# EasyEDA Pro project Cardy PCB.eprj

# Schematic Schematic
Create Date: 2023-10-29; Page Name: P1; Project Name: Cardy PCB; Schematic Name: Schematic; Update Date: 2023-10-31; Company: EasyEDA.com; Drawed: EasyEDA Pro; Page Size: A4; Part Number: JLCPCB-002; Reviewed: EasyEDA Pro; Version: V0.1
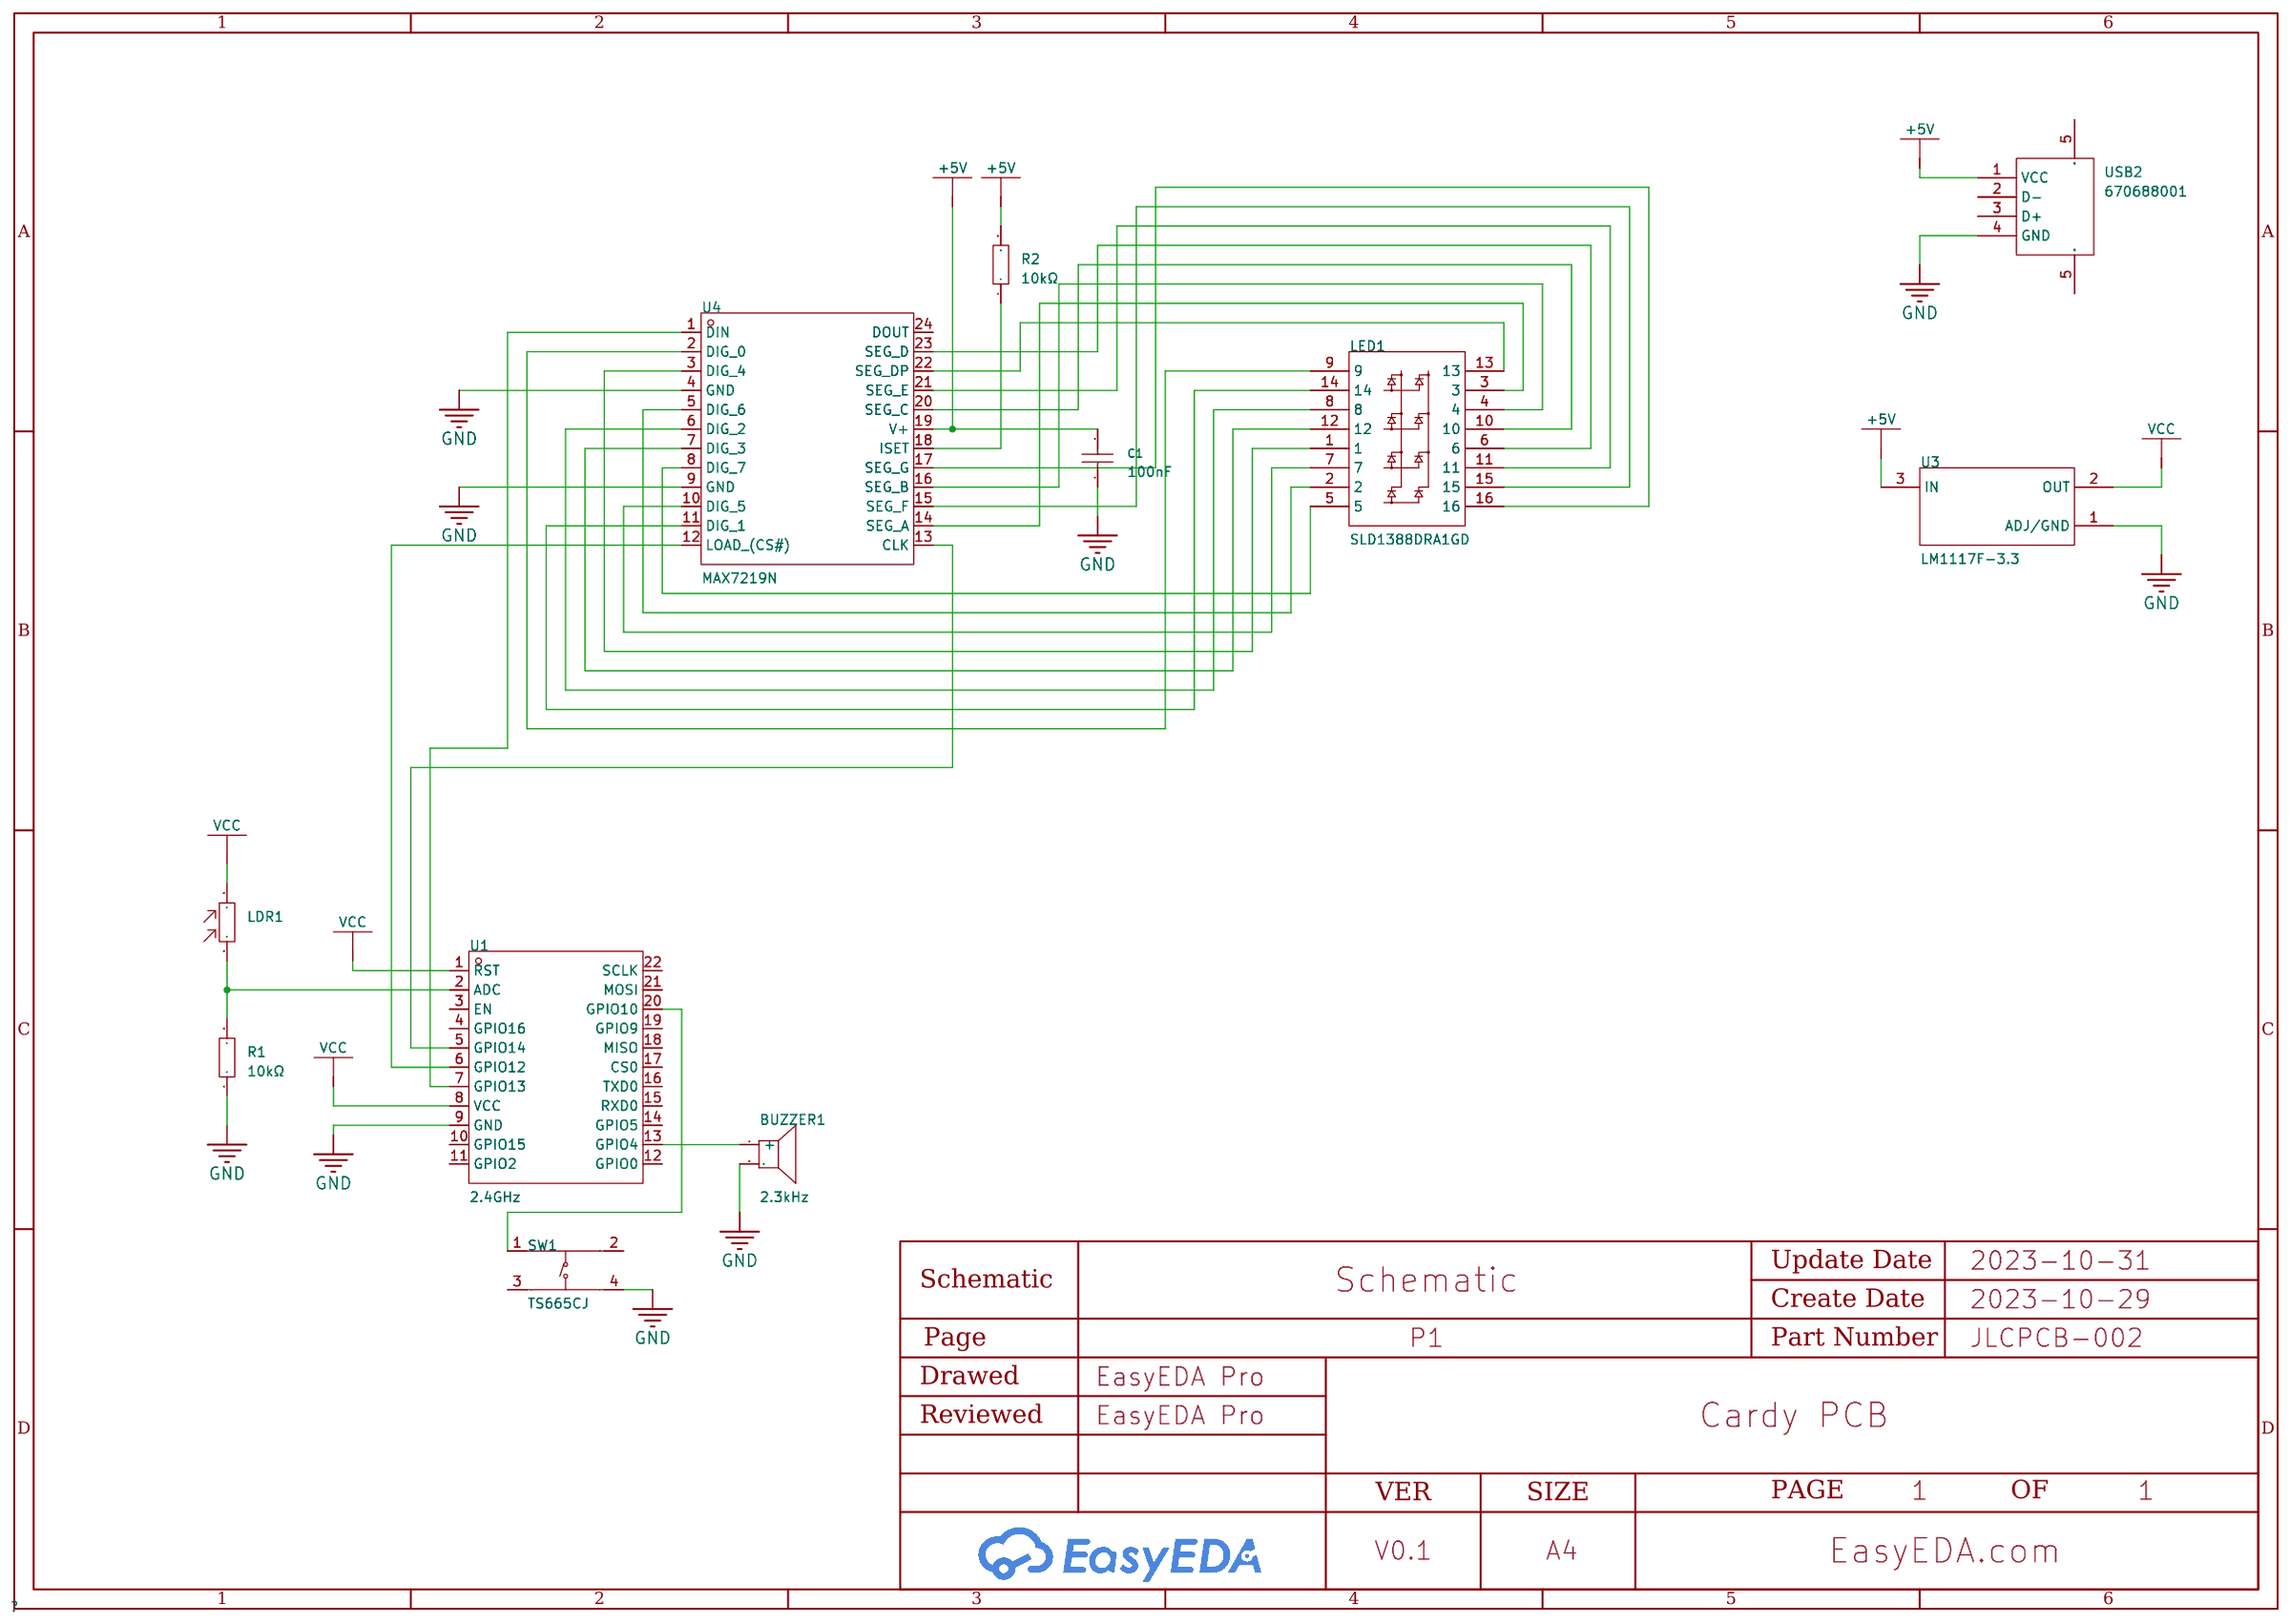
[diagram p0: schematic sheet]

## Parts
BUZZER1  2.3kHz  [BUZ-TH_BD12.0-P7.60-D0.6-FD]
C1  100nF  [CAP-TH_L5.0-W3.2-P5.00-D0.5]
LDR1  GL7520F  [RES-TH_BD9.2-P5.10-D0.5]
LED1  SLD1388DRA1GD  [LED-TH_SLD1388DRA1GD]
R1  10kΩ  [R_AXIAL-0.4]
R2  10kΩ  [R_AXIAL-0.4]
SW1  TS665CJ  [SW-TH_4P-L6.0-W6.0-P4.50-LS6.5]
U1  2.4GHz  [WIFIM-SMD_ESP-12F-ESP8266MOD]
U3  LM1117F-3.3  [SOT-89_L4.5-W2.5-P1.50-LS4.2-BR]
U4  MAX7219N  [DIP-24_L30.5-W7.5-P2.54-LS7.6-BL]
USB2  670688001  [USB-B_TH_670688001]

## Library data of the parts
BUZZER1 = TMB12A05: Oscillator Circuit:有源(内含驱动线路) Technology Type:电磁式 Rated Voltage:5V Operating Voltage:4V~8V Operating Voltage:4V~8V Frequency:2300Hz Sound Pressure Level (SPL):85dB@5V,10cm Diameter (φD):12mm Height:9.8mm; Supplier Part: C96093; Manufacturer: 华能; Supplier Footprint: 插件,D=12mm; JLCPCB Part Class: Extended Part; Datasheet: https://atta.szlcsc.com/upload/public/pdf/source/20170522/1495448324811.pdf; Supplier: LCSC; Oscillator Circuit: 有源(内含驱动线路); Technology Type: 电磁式; Rated Voltage: 5V; Operating Voltage: 4V~8V; Sound Pressure Level (SPL): 85dB@5V,10cm; Diameter (φD): 12mm; Height: 9.8mm
C1 = K104K20X7RH53H5: Capacitance:0.1uF Tolerance:±10% Tolerance:±10% Voltage Rated: Temperature Coefficient:; LCSC Part Name: 100nF ±10% 100V; Supplier Part: C1620208; Manufacturer: VISHAY(威世); Supplier Footprint: 插件; JLCPCB Part Class: Extended Part; Datasheet: https://atta.szlcsc.com/upload/public/pdf/source/20210702/6531D680143ED60327F22057485455BA.pdf; Supplier: LCSC; Tolerance: ±10%
LDR1 = GL7520F: Spectral Peak:- Applied Voltage:- Rise Time:- Fall Time:- Illuminated Resistance @ 10Lux:- Illuminated Resistance @ 10Lux:- Dark Resistance:- Operating Temperature:- Operating Temperature:-; LCSC Part Name: 金属壳光敏电阻; Supplier Part: C559398; Manufacturer: JCHL(晶创和立); Supplier Footprint: 插件,P=5.1mm; JLCPCB Part Class: Extended Part; Datasheet: https://atta.szlcsc.com/upload/public/pdf/source/20200525/C559398_0070AF689CC927ADE12252731EB1C686.pdf; Supplier: LCSC
LED1 = SLD1388DRA1GD_C2913075: Dot Matrix Number:8x8 Emitting Color:Red Polarity:共阳; LCSC Part Name: 8*8mm,红光,共阳LED点阵数码管,插件; Supplier Part: C2913075; Manufacturer: SUNLIGHT(光华); Supplier Footprint: 插件; JLCPCB Part Class: Extended Part; Datasheet: https://atta.szlcsc.com/upload/public/pdf/source/20180608/C225991_CE8A1D71268437AD8DFF1F8467A765B7.pdf; Supplier: LCSC; Dot Matrix Number: 8x8; Emitting Color: Red; Polarity: 共阳
R1 R2 = Res_AXIAL-1/4W: Supplier Footprint: Through
SW1 = TS665CJ: Contact Current:50mA Voltage Rating (DC):12V Circuit:SPST Mounting Style:Straight Actuator Style:Round Button With Lamp:- Mechanical Life:- Switch Length:6mm Switch Width:6mm Switch Height:5mm; LCSC Part Name: 6*6*5mm 直插 轻触开关; Supplier Part: C393938; Manufacturer: SHOU HAN(首韩); Supplier Footprint: 插件; JLCPCB Part Class: Extended Part; Datasheet: https://atta.szlcsc.com/upload/public/pdf/source/20190521/C393938_BDABEAC600B4C55E200A80AA129B70BC.pdf; Supplier: LCSC; Contact Current: 50mA; Voltage Rating (DC): 12V; Circuit: SPST; Mounting Style: Straight; Actuator Style: Round Button; Switch Length: 6mm; Switch Width: 6mm; Switch Height: 5mm
U1 = ESP-12F(ESP8266MOD): Frequency:2.4GHz Output Power:16dBm Output Power:16dBm Core Processor:ESP8266 Support Interface:GPIO；UART；I2C；PWM；SPI；ADC Antenna Type:PCB 板载天线 Wireless Standard:802.11b/g/n Operating Voltage:3.3V Operating Voltage:3.3V Receive  Current:120mA Send  Curren; LCSC Part Name: 完整的802.11b/g/n Wi-Fi的SoC模块; Supplier Part: C82891; Manufacturer: Ai-Thinker(安信可); Supplier Footprint: SMD,16x24mm; JLCPCB Part Class: Extended Part; Datasheet: https://atta.szlcsc.com/upload/public/pdf/source/20210219/C82891_ABD84A460F4F056A2757267CCCA4B508.pdf; Supplier: LCSC; Output Power: 16dBm; Core Processor: ESP8266; Support Interface: GPIO；UART；I2C；PWM；SPI；ADC; Antenna Type: PCB 板载天线; Wireless Standard: 802.11b/g/n; Operating Voltage: 3.3V; Receive  Current: 120mA; Send  Current: 170mA; Sensitivity: -90dBm; Operating Temperature: -40℃~+85℃
U3 = LM1117F-3.3: Output Type: Output Polarity:Positive Number of Outputs:1 Maximum Input Voltage:12V Output Voltage:3.3V~3.3V Output Voltage:3.3V~3.3V Dropout Voltage:1.3V@(1A) Output Current:1A Power Supply Rejection Ratio (PSRR):75dB@(120Hz); LCSC Part Name: 输入12V 输出3.3V 1A; Supplier Part: C126019; Manufacturer: HTC; Supplier Footprint: SOT-89; JLCPCB Part Class: Extended Part; Datasheet: https://atta.szlcsc.com/upload/public/pdf/source/20170814/C126019_1502678370674885891.pdf; Supplier: LCSC; Output Polarity: Positive; Number of Outputs: 1; Maximum Input Voltage: 12V; Output Voltage: 3.3V~3.3V; Dropout Voltage: 1.3V@(1A); Output Current: 1A; Power Supply Rejection Ratio (PSRR): 75dB@(120Hz)
U4 = MAX7219N: Supplier Part: C492111; Manufacturer: HGSEMI(华冠); Supplier Footprint: DIP-24; JLCPCB Part Class: Extended Part; Datasheet: https://atta.szlcsc.com/upload/public/pdf/source/20200309/C492111_D3D3867E45D81DF62D596A633A259E92.pdf; Supplier: LCSC
USB2 = 670688001: Standard:USB 2.0; LCSC Part Name: USB 2.0; Supplier Part: C490687; Manufacturer: MOLEX; Supplier Footprint: 插件; JLCPCB Part Class: Extended Part; Datasheet: https://atta.szlcsc.com/upload/public/pdf/source/20200305/C490687_24DD13E1E4238558D1E5995A4E47A994.pdf; Supplier: LCSC; Standard: USB 2.0

## Nets
+5V: C1.2 R2.2 U3.3(IN) U4.19(V+) USB2.1(VCC)
GND: BUZZER1.2 C1.1 R1.1 SW1.4(D) U1.9(GND) U3.1(ADJ/GND) U4.4(GND) U4.9(GND) USB2.4(GND)
VCC: LDR1.2 U1.1(RST) U1.8(VCC) U3.2(OUT)
$1N1621: LED1.5 U4.8(DIG 7)
$1N1628: LED1.2 U4.5(DIG 6)
$1N1635: LED1.7 U4.10(DIG 5)
$1N1642: LED1.1 U4.3(DIG 4)
$1N1649: LED1.12 U4.7(DIG 3)
$1N1662: LED1.8 U4.6(DIG 2)
$1N1676: LED1.14 U4.11(DIG 1)
$1N1683: LED1.9 U4.2(DIG 0)
$1N1690: LED1.13 U4.22(SEG DP)
$1N1704: LED1.3 U4.14(SEG A)
$1N1708: LED1.4 U4.16(SEG B)
$1N1721: LED1.10 U4.20(SEG C)
$1N1734: LED1.6 U4.23(SEG D)
$1N1754: LED1.11 U4.21(SEG E)
$1N1786: LED1.15 U4.15(SEG F)
$1N1797: LED1.16 U4.17(SEG G)
$1N1864: R2.1 U4.18(ISET)
$1N1906: U1.7(GPIO13) U4.1(DIN)
$1N1917: U1.5(GPIO14) U4.13(CLK)
$1N2339: LDR1.1 R1.2 U1.2(ADC)
$1N2953: U1.6(GPIO12) U4.12(LOAD (CS#))
$1N4031: SW1.1(A) U1.20(GPIO10)
$1N4041: BUZZER1.1(+) U1.13(GPIO4)

Not connected (* = marked no-connect by the designer): SW1 2(B) 3(C); U1 3(EN) 4(GPIO16) 10(GPIO15) 11(GPIO2) 12(GPIO0) 14(GPIO5) 15(RXD0) 16(TXD0) 17(CS0) 18(MISO) 19(GPIO9) 21(MOSI) 22(SCLK); U4 24(DOUT); USB2 2(D-) 3(D+) 5(SHLD)

# Board PCB2_1
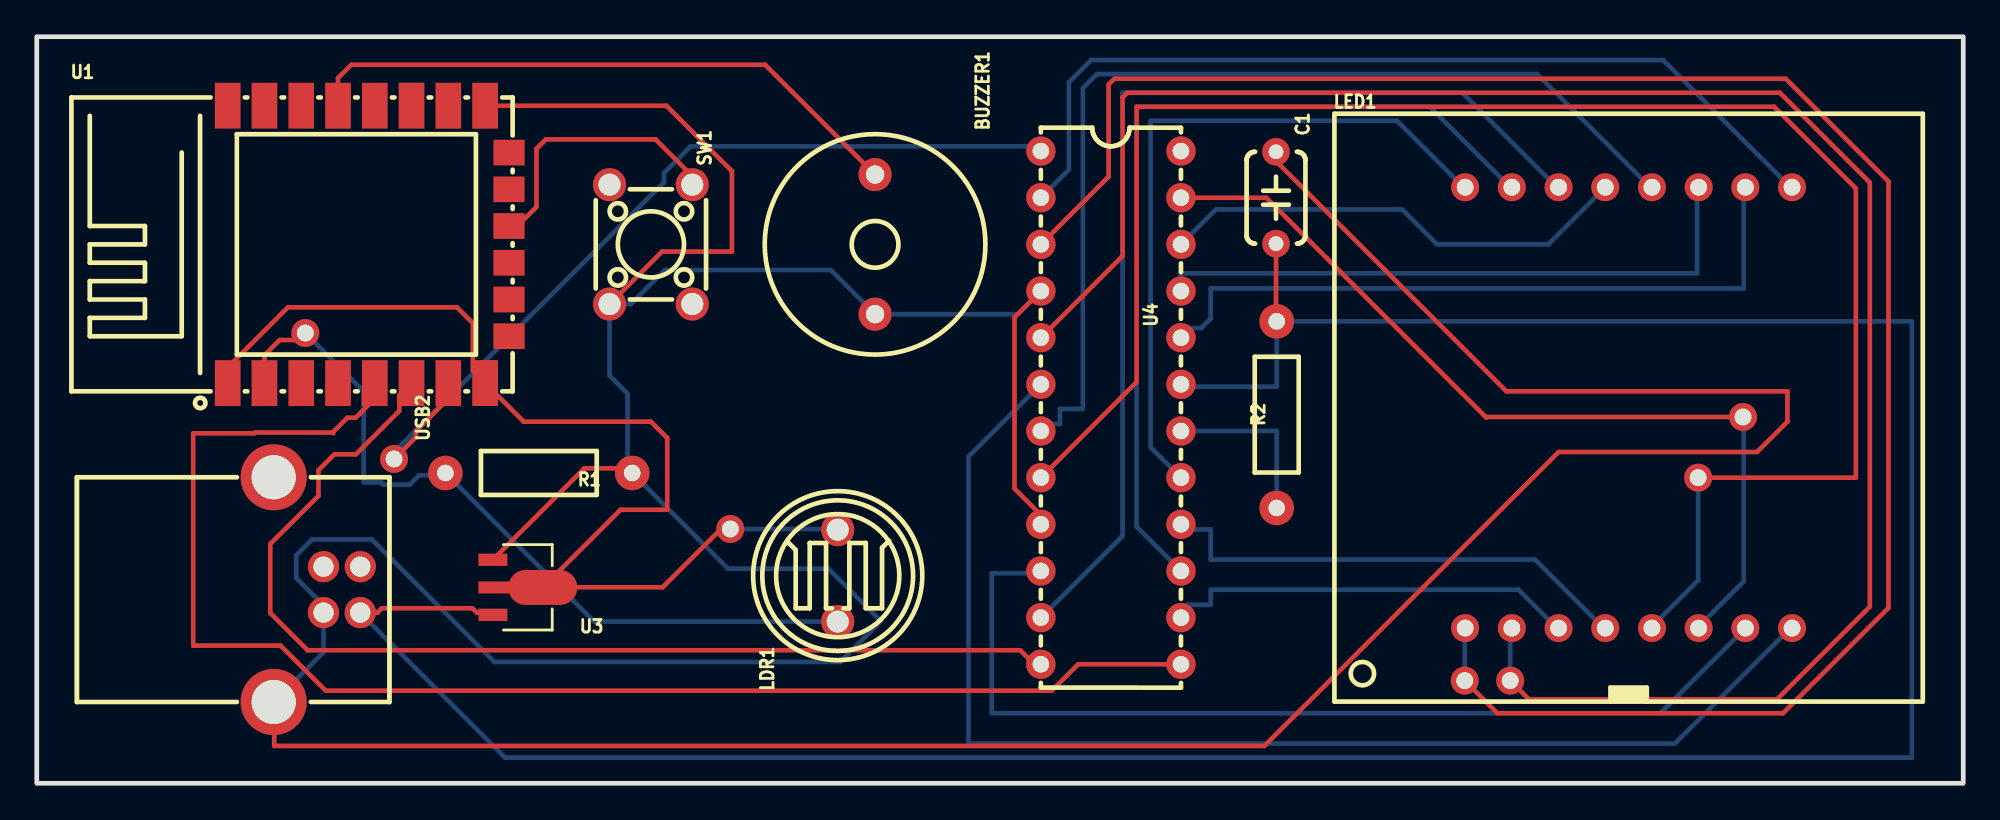
[diagram p1: board, top side]
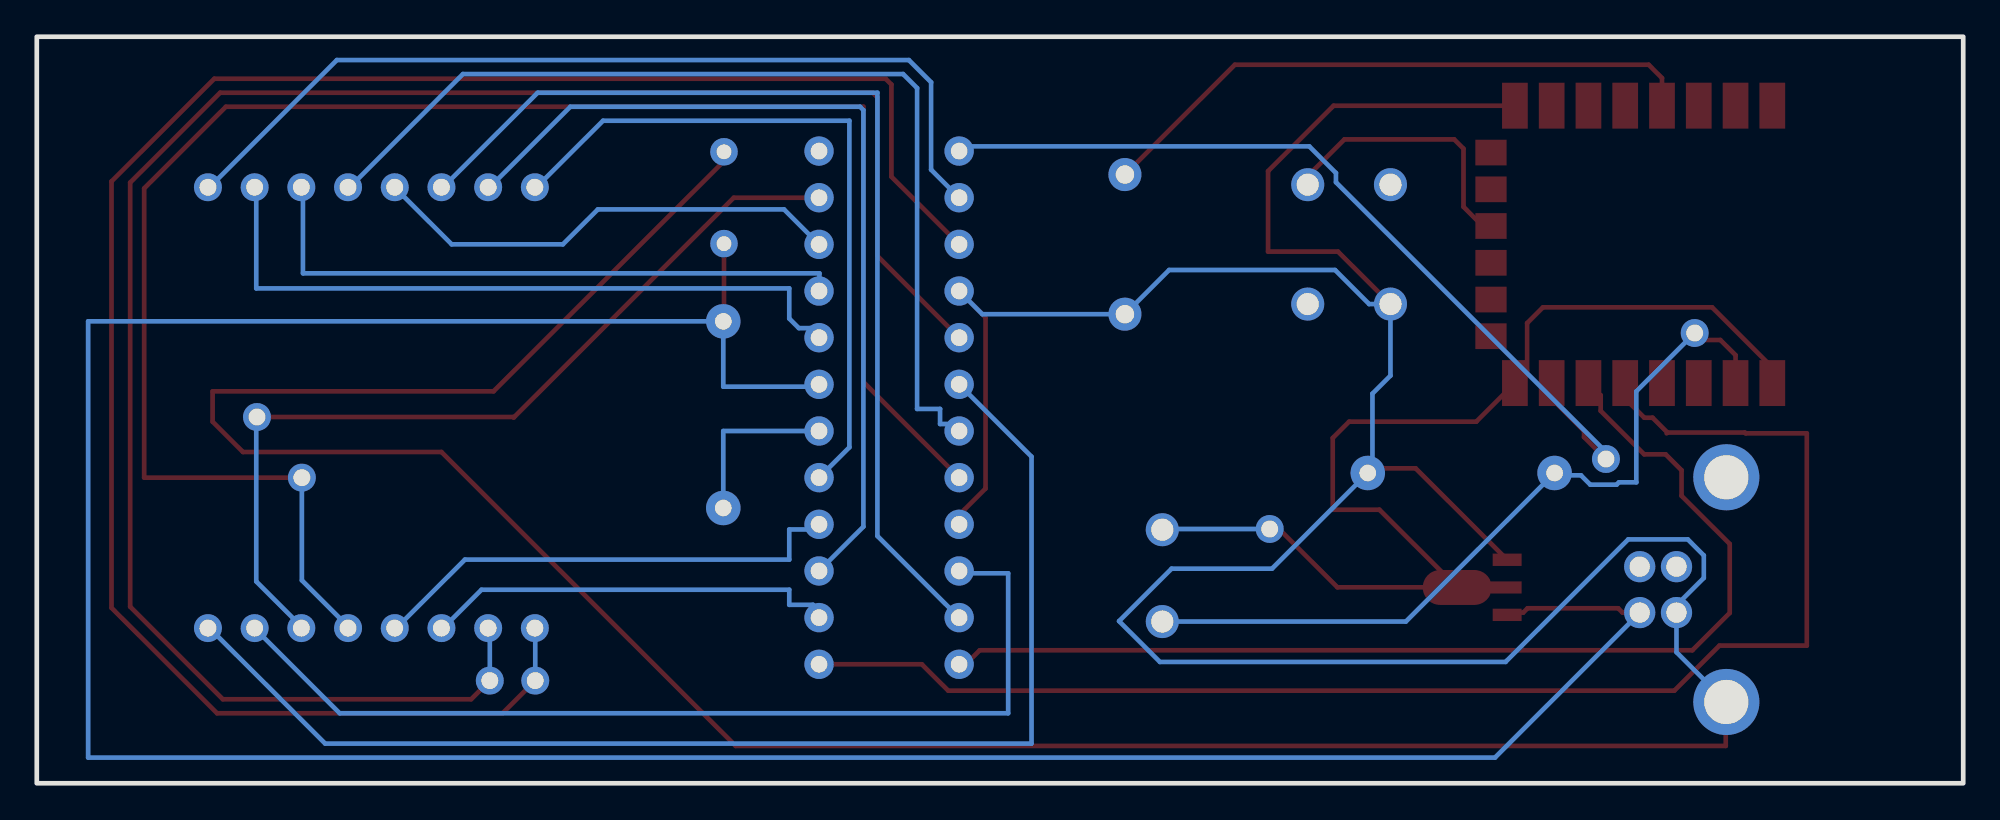
[diagram p2: board, bottom side, seen from below]

Outline 104.77 x 40.64 mm; copper layers: Top Layer, Bottom Layer. Coordinates in mm from the lower left corner of the outline.
Outline path: rectangle 0,40.64 104.77,0
Stack: Top Layer 0.035mm / Dielectric1 1.51mm FR4 er 4.5 / Bottom Layer 0.035mm

## Design rules (mm)
template: Custom Config
spacing copperThickness1oz (default): track to track 0.508, other pairs 0.152 to 0.508
spacing copperThickness2oz: track to track 0.152, other pairs 0.152 to 0.3
track width copperThickness1oz (default): min 0.127, default 0.254, max 2.54
track width copperThickness2oz: min 0.203, default 0.254, max 2.54
differential pair differentialPair (default): width min 0.127, default 0.254, max 2.54; gap min 0.152, default 0.152
via viaSize (default): diameter min 0.5, default 0.61, max 10; hole min 0.3, default 0.305, max 6.299

## Placement (name value [footprint] x y rotation side)
BUZZER1  2.3kHz  [BUZ-TH_BD12.0-P7.60-D0.6-FD]  45.59 29.34 270 top
C1  100nF  [CAP-TH_L5.0-W3.2-P5.00-D0.5]  67.4 31.88 270 top
LDR1  GL7520F  [RES-TH_BD9.2-P5.10-D0.5]  43.56 11.3 90 top
LED1  SLD1388DRA1GD  [LED-TH_SLD1388DRA1GD]  86.58 20.45 0 top
NOREF  -  [Pad_e323]  90.36 16.64 0 top
NOREF#2  -  [Pad_e334]  80.14 5.59 0 top
NOREF#3  -  [Pad_e264]  14.6 24.51 0 top
NOREF#4  -  [Pad_e214]  19.43 17.65 0 top
NOREF#5  -  [Pad_e195]  37.72 13.84 0 top
NOREF#6  -  [Pad_e335]  77.66 5.59 0 top
NOREF#7  -  [Pad_e216]  92.8 19.94 0 top
R1  10kΩ  [R_AXIAL-0.4]  27.3 16.89 180 top
R2  10kΩ  [R_AXIAL-0.4]  67.44 20.07 90 top
SW1  TS665CJ  [SW-TH_4P-L6.0-W6.0-P4.50-LS6.5]  33.4 29.34 270 top
U1  2.4GHz  [WIFIM-SMD_ESP-12F-ESP8266MOD]  18.03 29.34 0 top
U3  LM1117F-3.3  [SOT-89_L4.5-W2.5-P1.50-LS4.2-BR]  26.16 10.67 180 top
U4  MAX7219N  [DIP-24_L30.5-W7.5-P2.54-LS7.6-BL]  58.42 20.45 270 top
USB2  670688001  [USB-B_TH_670688001]  15.24 10.54 270 top

## Footprints (pads in the part's own frame, mm; a bottom-side part is the same pattern mirrored in y, then rotated)
BUZ-TH_BD12.0-P7.60-D0.6-FD
  round 1.8 hole 1: 1(-3.8,0) 2(3.8,0)
CAP-TH_L5.0-W3.2-P5.00-D0.5
  round 1.5 hole 0.8: 1(-2.5,0) 2(2.5,0)
DIP-24_L30.5-W7.5-P2.54-LS7.6-BL
  round 1.6 hole 0.9: 1(-13.97,-3.81) 2(-11.43,-3.81) 3(-8.89,-3.81) 4(-6.35,-3.81) 5(-3.81,-3.81) 6(-1.27,-3.81) 7(1.27,-3.81) 8(3.81,-3.81) 9(6.35,-3.81) 10(8.89,-3.81) 11(11.43,-3.81) 12(13.97,-3.81) 13(13.97,3.81) 14(11.43,3.81) 15(8.89,3.81) 16(6.35,3.81) 17(3.81,3.81) 18(1.27,3.81) 19(-1.27,3.81) 20(-3.81,3.81) 21(-6.35,3.81) 22(-8.89,3.81) 23(-11.43,3.81) 24(-13.97,3.81)
LED-TH_SLD1388DRA1GD
  round 1.524 hole 0.914: 1(-8.89,-12) 2(-6.35,-12) 3(-3.81,-12) 4(-1.27,-12) 5(1.27,-12) 6(3.81,-12) 7(6.35,-12) 8(8.89,-12) 9(8.89,12) 10(6.35,12) 11(3.81,12) 12(1.27,12) 13(-1.27,12) 14(-3.81,12) 15(-6.35,12) 16(-8.89,12)
Pad_e195
  round 1.524 hole 0.914: 3(0,0)
Pad_e214
  round 1.524 hole 0.914: 1(0,0)
Pad_e216
  round 1.524 hole 0.914: 4(0,0)
Pad_e264
  round 1.524 hole 0.914: 2(0,0)
Pad_e323
  round 1.524 hole 0.914: 5(0,0)
Pad_e334
  round 1.524 hole 0.914: 6(0,0)
Pad_e335
  round 1.524 hole 0.914: 7(0,0)
R_AXIAL-0.4
  round 1.879 hole 0.899: 1(-5.08,0) 2(5.08,0)
RES-TH_BD9.2-P5.10-D0.5
  round 1.8 hole 1.2: 1(-2.5,0) 2(2.5,0)
SOT-89_L4.5-W2.5-P1.50-LS4.2-BR
  rect 1.575x0.672 smd: 1(1.356,-1.5) 3(1.356,1.5)
  custom 5.377x1.9 smd: 2(-1.356,0.009)
SW-TH_4P-L6.0-W6.0-P4.50-LS6.5
  round 1.8 hole 1.2: 1(-3.25,2.25) 2(3.25,2.25) 3(-3.25,-2.25) 4(3.25,-2.25)
USB-B_TH_670688001
  round 1.7 hole 1.1: 1(1.25,2.355) 2(-1.25,2.355) 3(-1.25,0.355) 4(1.25,0.355)
  round 3.6 hole 2.4: 5(-6.117,-2.355) 5(6.117,-2.355)
WIFIM-SMD_ESP-12F-ESP8266MOD
  rect 1.4x2.5 smd: 1(-7.651,-7.551) 2(-5.651,-7.551) 3(-3.651,-7.551) 4(-1.651,-7.551) 5(0.349,-7.551) 6(2.349,-7.551) 7(4.349,-7.551) 8(6.349,-7.551) 9(6.349,7.548) 10(4.349,7.55) 11(2.349,7.551) 12(0.349,7.551) 13(-1.651,7.55) 14(-3.651,7.551) 15(-5.651,7.551) 16(-7.651,7.551)
  rect 1.7x1.4 smd: 17(7.651,-5) 18(7.649,-3.002) 19(7.649,-1.004) 20(7.649,0.998) 21(7.649,2.997) 22(7.651,4.997)

## Nets
+5V: C1.2 R2.2 U3.3 U4.19 USB2.1
GND: BUZZER1.2 C1.1 R1.1 SW1.4 U1.9 U3.1 U4.4 U4.9 USB2.4 USB2.5
VCC: LDR1.2 NOREF#5.3 U1.1 U1.8 U3.2
$1N1621: LED1.5 NOREF.5 U4.8
$1N1628: LED1.2 NOREF#2.6 U4.5
$1N1635: LED1.7 U4.10
$1N1642: LED1.1 NOREF#6.7 U4.3
$1N1649: LED1.12 U4.7
$1N1662: LED1.8 U4.6
$1N1676: LED1.14 U4.11
$1N1683: LED1.9 U4.2
$1N1690: LED1.13 U4.22
$1N1704: LED1.3 U4.14
$1N1708: LED1.4 U4.16
$1N1721: LED1.10 U4.20
$1N1734: LED1.6 NOREF#7.4 U4.23
$1N1754: LED1.11 U4.21
$1N1786: LED1.15 U4.15
$1N1797: LED1.16 U4.17
$1N1864: R2.1 U4.18
$1N1906: NOREF#4.1 U1.7 U4.1
$1N1917: U1.5 U4.13
$1N2339: LDR1.1 NOREF#3.2 R1.2 U1.2
$1N2953: U1.6 U4.12
$1N4031: SW1.1 U1.20
$1N4041: BUZZER1.1 U1.13

Pads without a net: SW1 2 3; U1 3 4 10 11 12 14 15 16 17 18 19 21 22; U4 24; USB2 2 3

## Routing (per net, layer and track width the routed paths; a pad name or vN(x,y) marks a point on that pad's centre or on a via; arc(x,y) is an arc through that point)
+5V: length 166.5
  Top Layer w0.254: 67.44,25.15 67.4,25.18 C1.2 ; USB2.1 18.53,9.29 18.76,9.53 23.7,9.53 23.93,9.29 24.68,9.29 24.81,9.17
  Bottom Layer w0.254: USB2.1 17.59,9.27 25.47,1.4 101.98,1.4 101.98,25.15 67.44,25.15 67.44,21.59 62.36,21.59 U4.19
GND: length 275.1
  Top Layer w0.254: USB2.5 12.92,4.39 12.92,2.03 66.76,2.03 82.77,18.03 93.56,18.03 95.21,19.69 95.21,21.34 79.93,21.34 67.4,33.87 C1.1 ; 32.13,17.15 29.78,17.15 24.81,12.17 ; U1.9 34.24,36.89 37.81,33.32 37.81,28.94 34.01,28.94 SW1.4 ; U4.4 53.17,25.36 53.17,16.04 54.61,14.61 U4.9
  Bottom Layer w0.254: R1.1 37.59,11.68 43.05,11.68 45.91,8.83 43.69,6.6 24.89,6.6 18.22,13.28 14.98,13.28 14.11,12.41 14.11,11.18 15.59,9.69 USB2.4 15.59,7.13 USB2.5 ; U4.4 53.35,25.54 BUZZER1.2 43.19,27.94 34.16,27.94 32.31,26.09 SW1.4 31.15,22.19 32.13,21.21 32.13,17.15
VCC: length 60.3
  Top Layer w0.254: 27.67,10.81 31.75,14.89 34.29,14.89 34.29,18.8 33.4,19.69 26.48,19.69 U1.8 23.72,22.45 23.72,25.05 22.86,25.91 13.66,25.91 10.38,22.63 U1.1 ; 27.67,10.81 27.82,10.67 34.04,10.67 37.21,13.84 NOREF#5.3 ; 27.67,10.81 U3.2
  Bottom Layer w0.254: LDR1.2 43.52,13.84 NOREF#5.3
$1N1621: length 96.9
  Top Layer w0.254: U4.8 59.82,21.84 59.82,36.83 94.49,36.83 98.93,32.39 98.93,16.64 NOREF.5
  Bottom Layer w0.254: 87.76,8.45 90.36,11.05 NOREF.5
$1N1628: length 105.7
  Top Layer w0.254: U4.5 59.05,28.7 59.05,37.34 59.31,37.59 94.8,37.59 99.7,32.7 99.7,9.61 94.65,4.57 81.15,4.57 NOREF#2.6
  Bottom Layer w0.254: NOREF#2.6 80.14,8.45
$1N1635: length 53.2
  Bottom Layer w0.254: 92.84,8.45 92.84,8.35 88.3,3.81 51.94,3.81 51.94,11.43 54.48,11.43 U4.10
$1N1642: length 107.4
  Top Layer w0.254: U4.3 58.29,33.02 58.29,38.04 58.61,38.35 95.12,38.35 100.71,32.76 100.71,9.55 94.97,3.81 79.44,3.81 NOREF#6.7
  Bottom Layer w0.254: NOREF#6.7 77.66,8.38 77.6,8.45
$1N1649: length 54.7
  Bottom Layer w0.254: 87.76,32.45 81.6,38.61 57.66,38.61 56.9,37.85 56.9,20.38 55.65,20.38 55.65,19.56 54.61,19.56 U4.7
$1N1662: length 68.5
  Bottom Layer w0.254: 95.38,8.45 89.09,2.16 50.67,2.16 50.67,17.78 U4.6
$1N1676: length 56.2
  Bottom Layer w0.254: U4.11 59.05,13.46 59.05,37.59 77.53,37.59 82.68,32.45
$1N1683: length 49.5
  Bottom Layer w0.254: U4.2 56.13,33.4 56.13,38.16 57.34,39.37 88.45,39.37 95.38,32.45
$1N1690: length 25.9
  Bottom Layer w0.254: U4.22 64.14,31.24 74.26,31.24 76.16,29.34 82.21,29.34 85.22,32.35 85.22,32.45
$1N1704: length 22.7
  Bottom Layer w0.254: U4.14 62.21,9.04 62.21,9.37 62.56,9.72 63.85,9.72 63.85,10.54 80.59,10.54 82.68,8.45
$1N1708: length 26.5
  Bottom Layer w0.254: 85.22,8.45 81.49,12.18 63.85,12.18 63.85,13.82 62.23,13.82 U4.16
$1N1721: length 38.2
  Bottom Layer w0.254: 92.84,32.45 92.84,26.94 63.85,26.94 63.85,25.3 63.33,24.78 62.71,24.78 62.21,24.28 U4.20
$1N1734: length 48.1
  Top Layer w0.254: NOREF#7.4 78.86,19.94 78.83,19.91 66.87,31.88 U4.23
  Bottom Layer w0.254: NOREF#7.4 92.84,19.9 92.84,10.99 90.3,8.45
$1N1754: length 34.6
  Bottom Layer w0.254: U4.21 62.21,26.82 62.21,27.76 90.3,27.76 90.3,32.45 90.06,32.68 90.06,32.11
$1N1786: length 48.3
  Bottom Layer w0.254: 80.14,32.45 75.75,36.83 60,36.83 59.82,36.65 59.82,13.97 U4.15
$1N1797: length 38.6
  Bottom Layer w0.254: 77.6,32.45 73.98,36.07 60.58,36.07 60.58,18.29 U4.17
$1N1864: length 9.4
  Bottom Layer w0.254: R2.1 67.44,19.18 U4.18
$1N1906: length 48.2
  Top Layer w0.254: U1.7 22.38,20.94 20.62,19.18 20.62,18.85 NOREF#4.1
  Bottom Layer w0.254: U4.1 54.36,34.67 35.56,34.67 34.12,33.22 34.12,32.72 19.43,18.03 NOREF#4.1
$1N1917: length 78.5
  Top Layer w0.254: U1.5 18.38,20.94 17.35,19.9 16.89,19.9 16.09,19.09 ; 16.09,19.09 16.13,19.05 ; 16.09,19.09 11.88,19.09 11.83,19.05 8.51,19.05 8.51,7.49 13.26,7.49 15.71,5.04 55.2,5.04 56.64,6.48 U4.13
$1N2339: length 43.1
  Top Layer w0.254: U1.2 12.38,23.31 13.21,24.13 14.22,24.13 NOREF#3.2
  Bottom Layer w0.254: NOREF#3.2 17.78,21.34 17.78,16.38 18.72,16.38 18.85,16.26 20.28,16.26 20.79,16.76 22.1,16.76 R1.2 30.31,8.8 LDR1.1
$1N2953: length 59.4
  Top Layer w0.254: U1.6 19.72,21.12 19.72,20.27 17.35,17.91 16.18,17.91 15.32,17.04 15.32,15.65 12.7,13.03 12.7,9.27 14.73,7.24 53.49,7.24 54.25,6.48 U4.12
$1N4031: length 15.1
  Top Layer w0.254: U1.20 26.13,30.33 27.18,31.38 27.18,34.54 27.69,35.05 33.65,35.05 35.65,33.06 SW1.1
$1N4041: length 33.5
  Top Layer w0.254: BUZZER1.1 39.61,39.12 17.11,39.12 16.38,38.39 U1.13
